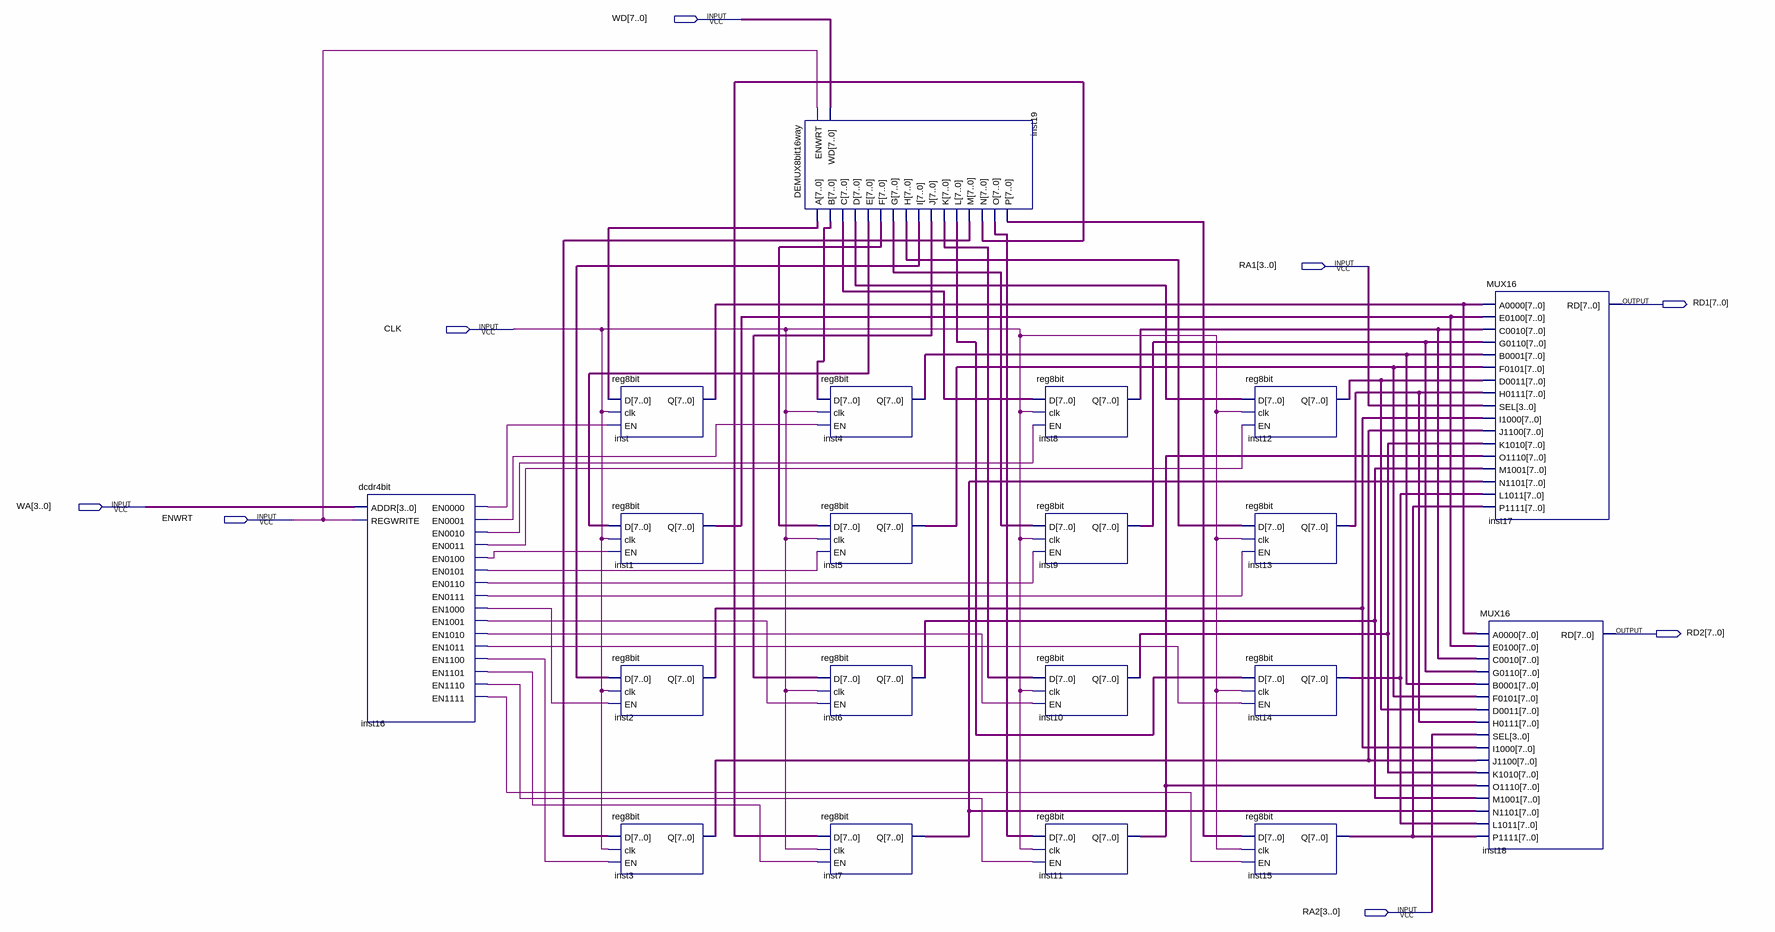
[diagram p0: schematic sheet]
// Quartus schematic regFile16by8bit.bdf as structural Verilog: 20 symbols, 8 pins
module regFile16by8bit (
  input  [7:0] WD,
  input  [3:0] RA1,
  input  CLK,
  input  [3:0] WA,
  input  ENWRT,
  input  [3:0] RA2,
  output [7:0] RD1,
  output [7:0] RD2
);

  wire inst16_en0000, inst16_en0001, inst16_en0010, inst16_en0011, inst16_en0100, inst16_en0101,
       inst16_en0110, inst16_en0111, inst16_en1000, inst16_en1001, inst16_en1010, inst16_en1011,
       inst16_en1100, inst16_en1101, inst16_en1110, inst16_en1111;
  wire [7:0] inst1_q, inst2_q, inst3_q, inst4_q, inst5_q, inst6_q, inst7_q, inst8_q, inst9_q, inst10_q,
       inst11_q, inst12_q, inst13_q, inst14_q, inst15_q, inst19_a, inst19_b, inst19_c, inst19_d, inst19_e,
       inst19_f, inst19_g, inst19_h, inst19_i, inst19_j, inst19_k, inst19_l, inst19_m, inst19_n, inst19_o,
       inst19_p, inst_q;

  dcdr4bit inst16 (
    .ADDR(WA), .REGWRITE(ENWRT), .EN0000(inst16_en0000), .EN0001(inst16_en0001), .EN0010(inst16_en0010),
    .EN0011(inst16_en0011), .EN0100(inst16_en0100), .EN0101(inst16_en0101), .EN0110(inst16_en0110),
    .EN0111(inst16_en0111), .EN1000(inst16_en1000), .EN1001(inst16_en1001), .EN1010(inst16_en1010),
    .EN1011(inst16_en1011), .EN1100(inst16_en1100), .EN1101(inst16_en1101), .EN1110(inst16_en1110),
    .EN1111(inst16_en1111));
  reg8bit inst (.D(inst19_a), .clk(CLK), .EN(inst16_en0000), .Q(inst_q));
  reg8bit inst1 (.D(inst19_e), .clk(CLK), .EN(inst16_en0100), .Q(inst1_q));
  reg8bit inst2 (.D(inst19_i), .clk(CLK), .EN(inst16_en1000), .Q(inst2_q));
  reg8bit inst3 (.D(inst19_m), .clk(CLK), .EN(inst16_en1100), .Q(inst3_q));
  DEMUX8bit16way inst19 (
    .ENWRT(ENWRT), .WD(WD), .A(inst19_a), .B(inst19_b), .C(inst19_c), .D(inst19_d), .E(inst19_e),
    .F(inst19_f), .G(inst19_g), .H(inst19_h), .I(inst19_i), .J(inst19_j), .K(inst19_k), .L(inst19_l),
    .M(inst19_m), .N(inst19_n), .O(inst19_o), .P(inst19_p));
  reg8bit inst4 (.D(inst19_b), .clk(CLK), .EN(inst16_en0001), .Q(inst4_q));
  reg8bit inst5 (.D(inst19_f), .clk(CLK), .EN(inst16_en0101), .Q(inst5_q));
  reg8bit inst6 (.D(inst19_j), .clk(CLK), .EN(inst16_en1001), .Q(inst6_q));
  reg8bit inst7 (.D(inst19_n), .clk(CLK), .EN(inst16_en1101), .Q(inst7_q));
  reg8bit inst8 (.D(inst19_c), .clk(CLK), .EN(inst16_en0010), .Q(inst8_q));
  reg8bit inst9 (.D(inst19_g), .clk(CLK), .EN(inst16_en0110), .Q(inst9_q));
  reg8bit inst10 (.D(inst19_k), .clk(CLK), .EN(inst16_en1010), .Q(inst10_q));
  reg8bit inst11 (.D(inst19_o), .clk(CLK), .EN(inst16_en1110), .Q(inst11_q));
  reg8bit inst12 (.D(inst19_d), .clk(CLK), .EN(inst16_en0011), .Q(inst12_q));
  reg8bit inst13 (.D(inst19_h), .clk(CLK), .EN(inst16_en0111), .Q(inst13_q));
  reg8bit inst14 (.D(inst19_l), .clk(CLK), .EN(inst16_en1011), .Q(inst14_q));
  reg8bit inst15 (.D(inst19_p), .clk(CLK), .EN(inst16_en1111), .Q(inst15_q));
  MUX16 inst17 (
    .A0000(inst_q), .E0100(inst1_q), .C0010(inst8_q), .G0110(inst9_q), .B0001(inst4_q), .F0101(inst5_q),
    .D0011(inst12_q), .H0111(inst13_q), .SEL(RA1), .I1000(inst2_q), .J1100(inst3_q), .K1010(inst10_q),
    .O1110(inst11_q), .M1001(inst6_q), .N1101(inst7_q), .L1011(inst14_q), .P1111(inst15_q), .RD(RD1));
  MUX16 inst18 (
    .A0000(inst_q), .E0100(inst1_q), .C0010(inst8_q), .G0110(inst9_q), .B0001(inst4_q), .F0101(inst5_q),
    .D0011(inst12_q), .H0111(inst13_q), .SEL(RA2), .I1000(inst2_q), .J1100(inst3_q), .K1010(inst10_q),
    .O1110(inst11_q), .M1001(inst6_q), .N1101(inst7_q), .L1011(inst14_q), .P1111(inst15_q), .RD(RD2));
endmodule
